# Altium schematic sheet power.SchDoc
size A3; SheetNumber: 5; SheetTotal: 7
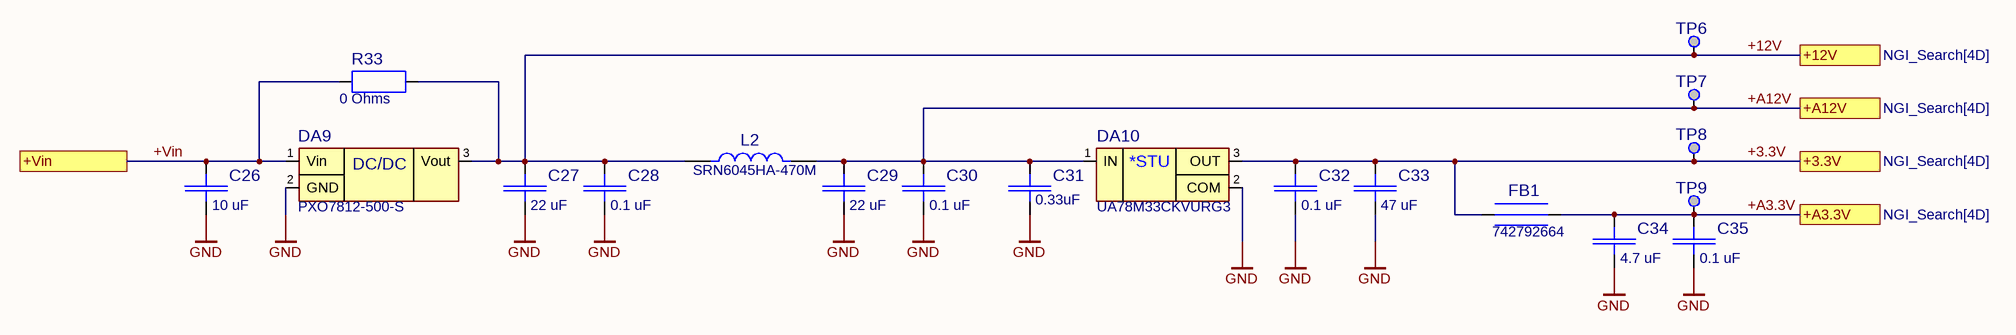
[diagram p0: power.SchDoc]

## Parts
C26  value 10 uF  [Capacitor0805_THICKNESS1.45]  (hidden comment: GRM21BR6YA106KE43K)
C27  value 22 uF  [Capacitor1206_THICKNESS1.6]  (hidden comment: C3216X5R1V226M160AC)
C28  value 0.1 uF  [Capacitor0805_THICKNESS0.8]  (hidden comment: CL21B104KBCNNWC)
C29  value 22 uF  [Capacitor1206_THICKNESS1.6]  (hidden comment: C3216X5R1V226M160AC)
C30  value 0.1 uF  [Capacitor0805_THICKNESS0.8]  (hidden comment: CL21B104KBCNNWC)
C31  value 0.33uF  [Capacitor0805_THICKNESS1.25]  (hidden comment: CC0805KKX7R8BB334)
C32  value 0.1 uF  [Capacitor0805_THICKNESS0.8]  (hidden comment: CL21B104KBCNNWC)
C33  value 47 uF  [Capacitor0805_THICKNESS1.25]  (hidden comment: GRM21BR61A476ME15K)
C34  value 4.7 uF  [Capacitor0805_THICKNESS1.25]  (hidden comment: CL21A475KAQNNNF)
C35  value 0.1 uF  [Capacitor0805_THICKNESS0.8]  (hidden comment: CL21B104KBCNNWC)
DA9  PXO7812-500-S  [PXO7812-500-S_POSITIVEOUTPUT]
DA10  UA78M33CKVURG3  [TO-252 3pin THICKNESS2.52]
FB1  742792664  [742792664_Ferrite Beads_0603]
L2  SRN6045HA-470M  [SRN6045HA-470M]
R33  value 0 Ohms  [Resistor1206_THICKNESS0.65]  (hidden comment: RC1206FR-070RL)
TP6  test point  [test point]  (value not drawn)
TP7  test point  [test point]  (value not drawn)
TP8  test point  [test point]  (value not drawn)
TP9  test point  [test point]  (value not drawn)

## Ports
+3.3V (see NGI_Search[4D]), +12V (see NGI_Search[4D]), +A3.3V (see NGI_Search[4D]), +A12V (see NGI_Search[4D]), +Vin (see NGI_Search[3D], Regulated voltage input source[2A])

## Nets
GND: C26.1 C27.1 C28.1 C29.1 C30.1 C31.1 C32.1 C33.1 C34.1 C35.1 DA9.2(GND) DA10.2(COM)
+3.3V: C32.2 C33.2 DA10.3(OUT) FB1.1 TP8.1 ; port +3.3V
+12V: C27.2 C28.2 DA9.3(Vout) L2.1 R33.2 TP6.1 ; port +12V
+A3.3V: C34.2 C35.2 FB1.2 TP9.1 ; port +A3.3V
+A12V: C29.2 C30.2 C31.2 DA10.1(IN) L2.2 TP7.1 ; port +A12V
+Vin: C26.2 DA9.1(Vin) R33.1 ; port +Vin

## Notes on the sheet
- (in symbol PXO7812-500-S) DC/DC
- (in symbol UA78M33CKVURG3) *STU

## Library data of the parts
C26 = GRM21BR6YA106KE43K: Multilayer Ceramic Capacitors MLCC - SMD/SMT 10 uF 35 VDC 10% 0805 X5R; Manufacturer: Murata; Power/Voltage: 35V; Tolerance: 10%; Dielectric: X5R; ManufacturerPartNumber: GRM21BR6YA106KE43K; Mouser Price/Stock: https://eu.mouser.com/ProductDetail/Murata-Electronics/GRM21BR6YA106KE43K?qs=QzBtWTOodeW8NrklCAafzg%3D%3D; Case: 0805; Datasheet Link: https://eu.mouser.com/datasheet/2/281/1/GRM21BR6YA106KE43_01A-1986981.pdf; Mouser Part Number: 81-GRM21BR6YA106KE3K
C27 C29 = C3216X5R1V226M160AC: Multilayer Ceramic Capacitors MLCC - SMD/SMT 1206 35V 22uF X5R 20% T: 1.6mm; Manufacturer: TDK; Case: 1206; Datasheet Link: https://product.tdk.com/system/files/dam/doc/product/capacitor/ceramic/mlcc/catalog/mlcc_commercial_general_en.pdf; Dielectric: X5R; ManufacturerPartNumber: C3216X5R1V226M160AC; Mouser Part Number: 810-C3216X5R1V226M; Mouser Price/Stock: https://eu.mouser.com/ProductDetail/TDK/C3216X5R1V226M160AC?qs=NRhsANhppD8TwN31eZ1xGQ%3D%3D; Power/Voltage: 35V; Tolerance: 20%
C28 C30 C32 C35 = CL21B104KBCNNWC: Multilayer Ceramic Capacitors MLCC - SMD/SMT 100nF+/-10% 50V X7R 0805; Manufacturer: Samsung Electro-Mechanics; Tolerance: 10%; Dielectric: X7R; ManufacturerPartNumber: CL21B104KBCNNWC; Mouser Price/Stock: https://eu.mouser.com/ProductDetail/Samsung-Electro-Mechanics/CL21B104KBCNNWC?qs=yOVawPpwOwlu2UTVxWhmlw%3D%3D; Power/Voltage: 50V; Case: 0805; Datasheet Link: https://eu.mouser.com/datasheet/2/585/MLCC-1837944.pdf; Mouser Part Number: 187-CL21B104KBCNNWC
C31 = CC0805KKX7R8BB334: Multilayer Ceramic Capacitors MLCC - SMD/SMT 25V 0.33uF X7R 0805 10%; Manufacturer: YAGEO; Case: 0805; Datasheet Link: https://eu.mouser.com/datasheet/2/447/UPY_GPHC_X7R_6_3V_to_250V_23-3084653.pdf; Dielectric: X7R; ManufacturerPartNumber: CC0805KKX7R8BB334; Mouser Part Number: 603-CC805KKX7R8BB334; Mouser Price/Stock: https://eu.mouser.com/ProductDetail/YAGEO/CC0805KKX7R8BB334?qs=sGAEpiMZZMvsSlwiRhF8qhv%252BGHtcCd98Tol7cGM2QGw%3D; Power/Voltage: 25V; Tolerance: 10%
C33 = GRM21BR61A476ME15K: Multilayer Ceramic Capacitors MLCC - SMD/SMT 47 uF 10 VDC 20% 0805 X5R; Manufacturer: Murata; Power/Voltage: 10V; Case: 0805; Datasheet Link: https://eu.mouser.com/datasheet/2/281/1/GRM21BR61A476ME15_01A-1986931.pdf; Dielectric: X5R; ManufacturerPartNumber: GRM21BR61A476ME15K; Mouser Part Number: 81-GRM21BR61A476ME5K; Mouser Price/Stock: https://eu.mouser.com/ProductDetail/Murata-Electronics/GRM21BR61A476ME15K?qs=sGAEpiMZZMvsSlwiRhF8qtKev7nvVKumdokzOmlxZZTbnZpuci0nOw%3D%3D; Tolerance: 20%
C34 = CL21A475KAQNNNF: Multilayer Ceramic Capacitors MLCC - SMD/SMT 4.7uF+/-10% 25V X5R 0805; Manufacturer: Samsung Electro-Mechanics; Tolerance: 10%; Case: 0805; Datasheet Link: https://eu.mouser.com/datasheet/2/585/MLCC-1837944.pdf; Dielectric: X5R; ManufacturerPartNumber: CL21A475KAQNNNF; Mouser Part Number: 187-CL21A475KAQNNNF; Mouser Price/Stock: https://eu.mouser.com/ProductDetail/Samsung-Electro-Mechanics/CL21A475KAQNNNF?qs=sGAEpiMZZMvsSlwiRhF8qtsGU%2FCnaNeQ9%2FtqxdEQLsBh1lK0%252BjEvRQ%3D%3D; Power/Voltage: 25V
DA9 = PXO7812-500-S: Non-Isolated DC/DC Converters dc-dc non-isolated, 0.5 A, 15-36 Vdc input, 12 Vdc output, SIP; Manufacturer: CUI Inc.; Case: POSITIVEOUTPUT; Datasheet Link: https://eu.mouser.com/datasheet/2/670/pxo78_500_s-3313217.pdf; ManufacturerPartNumber: PXO7812-500-S; Mouser Part Number: 490-PXO7812-500-S; Mouser Price/Stock: https://eu.mouser.com/ProductDetail/CUI-Inc/PXO7812-500-S?qs=Y0Uzf4wQF3kdbacxg4U5TQ%3D%3D
DA10 = UA78M33CKVURG3: Linear Voltage Regulators 3.3 V 500mA Fix Pos Voltage Regulator; Manufacturer: Texas Instruments; Case: TO-252 3pin; Datasheet Link: https://www.ti.com/lit/ds/symlink/ua78m.pdf?ts=1704830544530&ref_url=https%253A%252F%252Fwww.mouser.ch%252F; ManufacturerPartNumber: UA78M33CKVURG3; Mouser Part Number: 595-UA78M33CKVURG3; Mouser Price/Stock: https://eu.mouser.com/ProductDetail/Texas-Instruments/UA78M33CKVURG3?qs=0O%2FZFlpUpJXrDg4gfD1Q2g%3D%3D
FB1 = 742792664: Ferrite Beads WE-CBF 0603 100MHz 1000Ohm 300mA AEC-Q200; Manufacturer: Wurth Elektronik; Case: 0603; Datasheet Link: https://www.we-online.com/components/products/datasheet/742792664.pdf; ManufacturerPartNumber: 742792664; Maximum Current: 300 mA; Mouser Part Number: 710-742792664; Mouser Price/Stock: https://eu.mouser.com/ProductDetail/Wurth-Elektronik/742792664?qs=5twSNpOB8ICHwt6lnbKGWQ%3D%3D; Value: 1000Ohm; Frequency: 100 MHz
L2 = SRN6045HA-470M: Power Inductors - SMD Ind,6x6x4.7mm,47uH+/-20%,1A,semi-shd; Manufacturer: Bourns; Maximum Resistance: 305 mOhms; Tolerance: 20%; Value: 47 uH; Case: R55; Datasheet Link: https://eu.mouser.com/datasheet/2/54/SRN6045HA_datasheet-2498144.pdf; ManufacturerPartNumber: SRN6045HA-470M; Maximum Current: 1 A; Mouser Part Number: 652-SRN6045HA-470M; Mouser Price/Stock: https://eu.mouser.com/ProductDetail/Bourns/SRN6045HA-470M?qs=e8oIoAS2J1TQqJ%2FyaON1CQ%3D%3D
R33 = RC1206FR-070RL: Thick Film Resistors 0 Ohms 250 mW 1206 1%; Manufacturer: YAGEO; Power/Voltage: 250 mW / 200 V; Case: 1206; Datasheet Link: https://eu.mouser.com/datasheet/2/447/YAGEO_PYu_RC_Group_51_RoHS_L_12-3313492.pdf; ManufacturerPartNumber: RC1206FR-070RL; Mouser Part Number: 603-RC1206FR-070RL; Mouser Price/Stock: https://eu.mouser.com/ProductDetail/YAGEO/RC1206FR-070RL?qs=sGAEpiMZZMvdGkrng054t3pr%252BPE%2FADjs%252BFqZDLJFx1g%3D; Tolerance: 1%